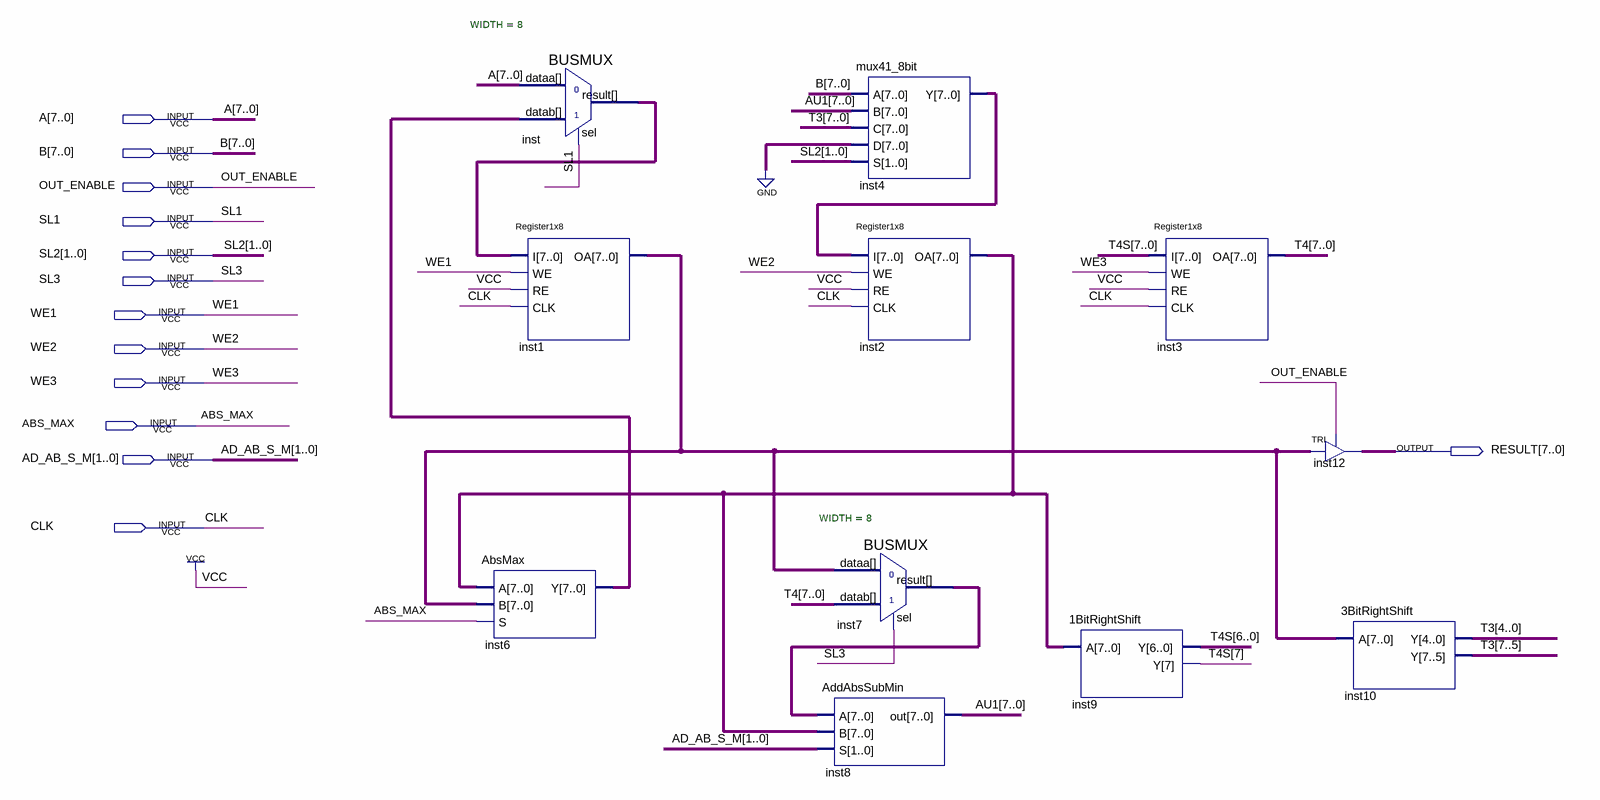
[diagram p0: schematic sheet]
// Quartus schematic sra_data.bdf as structural Verilog: 11 symbols, 13 pins
module sra_data (
  input  [7:0] A,
  input  [7:0] B,
  input  OUT_ENABLE,
  input  SL1,
  input  [1:0] SL2,
  input  SL3,
  input  WE1,
  input  WE2,
  input  WE3,
  input  ABS_MAX,
  input  [1:0] AD_AB_S_M,
  input  CLK,
  output [7:0] RESULT
);

  wire [7:0] AU1, inst1_oa, inst2_oa, inst4_y, inst6_y, inst7_result, inst_result, T3, T4, T4S;

  Register1x8 inst1 (.I(inst_result), .WE(WE1), .RE(1'b1), .CLK(CLK), .OA(inst1_oa));
  AbsMax inst6 (.A(inst2_oa), .B(inst1_oa), .S(ABS_MAX), .Y(inst6_y));
  BUSMUX #(.WIDTH(8)) inst (.datab(inst6_y), .sel(SL1), .dataa(A), .result(inst_result));
  mux41_8bit inst4 (.A(B), .B(AU1), .C(T3), .D({8{1'b0}}), .S(SL2), .Y(inst4_y));
  Register1x8 inst2 (.I(inst4_y), .WE(WE2), .RE(1'b1), .CLK(CLK), .OA(inst2_oa));
  BUSMUX #(.WIDTH(8)) inst7 (.datab(T4), .sel(SL3), .dataa(inst1_oa), .result(inst7_result));
  AddAbsSubMin inst8 (.A(inst7_result), .B(inst2_oa), .S(AD_AB_S_M), .out(AU1));
  \1BitRightShift  inst9 (.A(inst2_oa), .Y(T4S));
  Register1x8 inst3 (.I(T4S), .WE(WE3), .RE(1'b1), .CLK(CLK), .OA(T4));
  TRI inst12[7:0] (.IN(inst1_oa), .OE(OUT_ENABLE), .OUT(RESULT));
  \3BitRightShift  inst10 (.A(inst1_oa), .Y(T3));
endmodule
